# Altium project Acoustics_4.PrjPcb
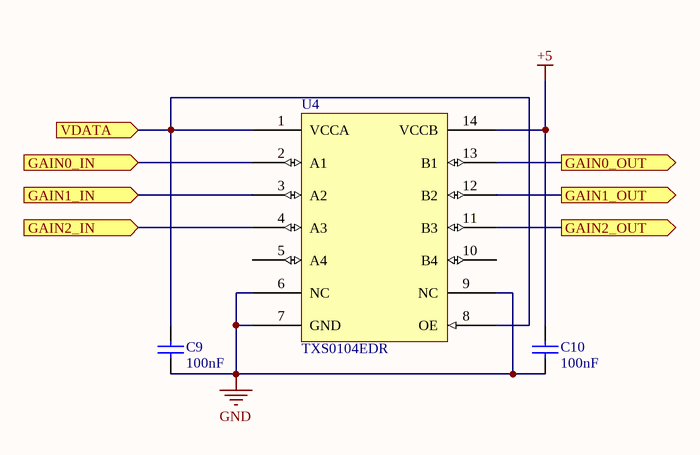
[diagram p0: Control.SchDoc]
1 sheet, 3 parts. Net scope: flat (ports and power ports of the same name join across sheets).
Board file: Acoustics_4.PcbDoc

## Sheet Control.SchDoc
size A; SheetNumber: 3; SheetTotal: 4

### Parts
C9  100nF  [CAPC1608X10M]
C10  100nF  [CAPC1608X10M]
U4  TXS0104EDR  [SOIC127P600X175-14M]

### Ports
GAIN0_IN (in), GAIN0_OUT (out), GAIN1_IN (in), GAIN1_OUT (out), GAIN2_IN (in), GAIN2_OUT (out), VDATA (in)

### Nets
+5: C10.2 U4.14(VCCB)
GND: C9.1 C10.1 U4.6(NC) U4.7(GND) U4.9(NC)
NetC9_2: C9.2 U4.1(VCCA) U4.8(OE) ; port VDATA
NetU4_2: U4.2(A1) ; port GAIN0_IN
NetU4_3: U4.3(A2) ; port GAIN1_IN
NetU4_4: U4.4(A3) ; port GAIN2_IN
NetU4_11: U4.11(B3) ; port GAIN2_OUT
NetU4_12: U4.12(B2) ; port GAIN1_OUT
NetU4_13: U4.13(B1) ; port GAIN0_OUT

Not connected (* = marked no-connect by the designer): U4 5(A4) 10(B4)

### Library data of the parts
C9 C10 = GRM188: GRM188 0603(1.6mm*0.8mm) ±5% and ±10% (15pF-2.2uF) SMD Capacitor; Published: 8-Jun-2000; LatestRevisionDate: 17-Jul-2002; LatestRevisionNote: Re-released for DXP Platform.; PackageReference: RAD-0.3; Publisher: Altium Limited; PackageDescription: Radial Cap, Thru-Hole; 2 Leads; 0.3 in Pin Spacing
U4 = TXS0104EDR: Voltage Level Translator Bidirectional 1 Circuit 4 Channel 24Mbps 14-SOIC; ComponentLink1Description: Datasheet; ComponentLink1URL: https://www.ti.com/general/docs/suppproductinfo.tsp?distId=10&gotoUrl=https%3A%2F%2Fwww.ti.com%2Flit%2Fgpn%2Ftxs0104e